# EAGLE design hashlet_bbb (EAGLE 6.5.0)
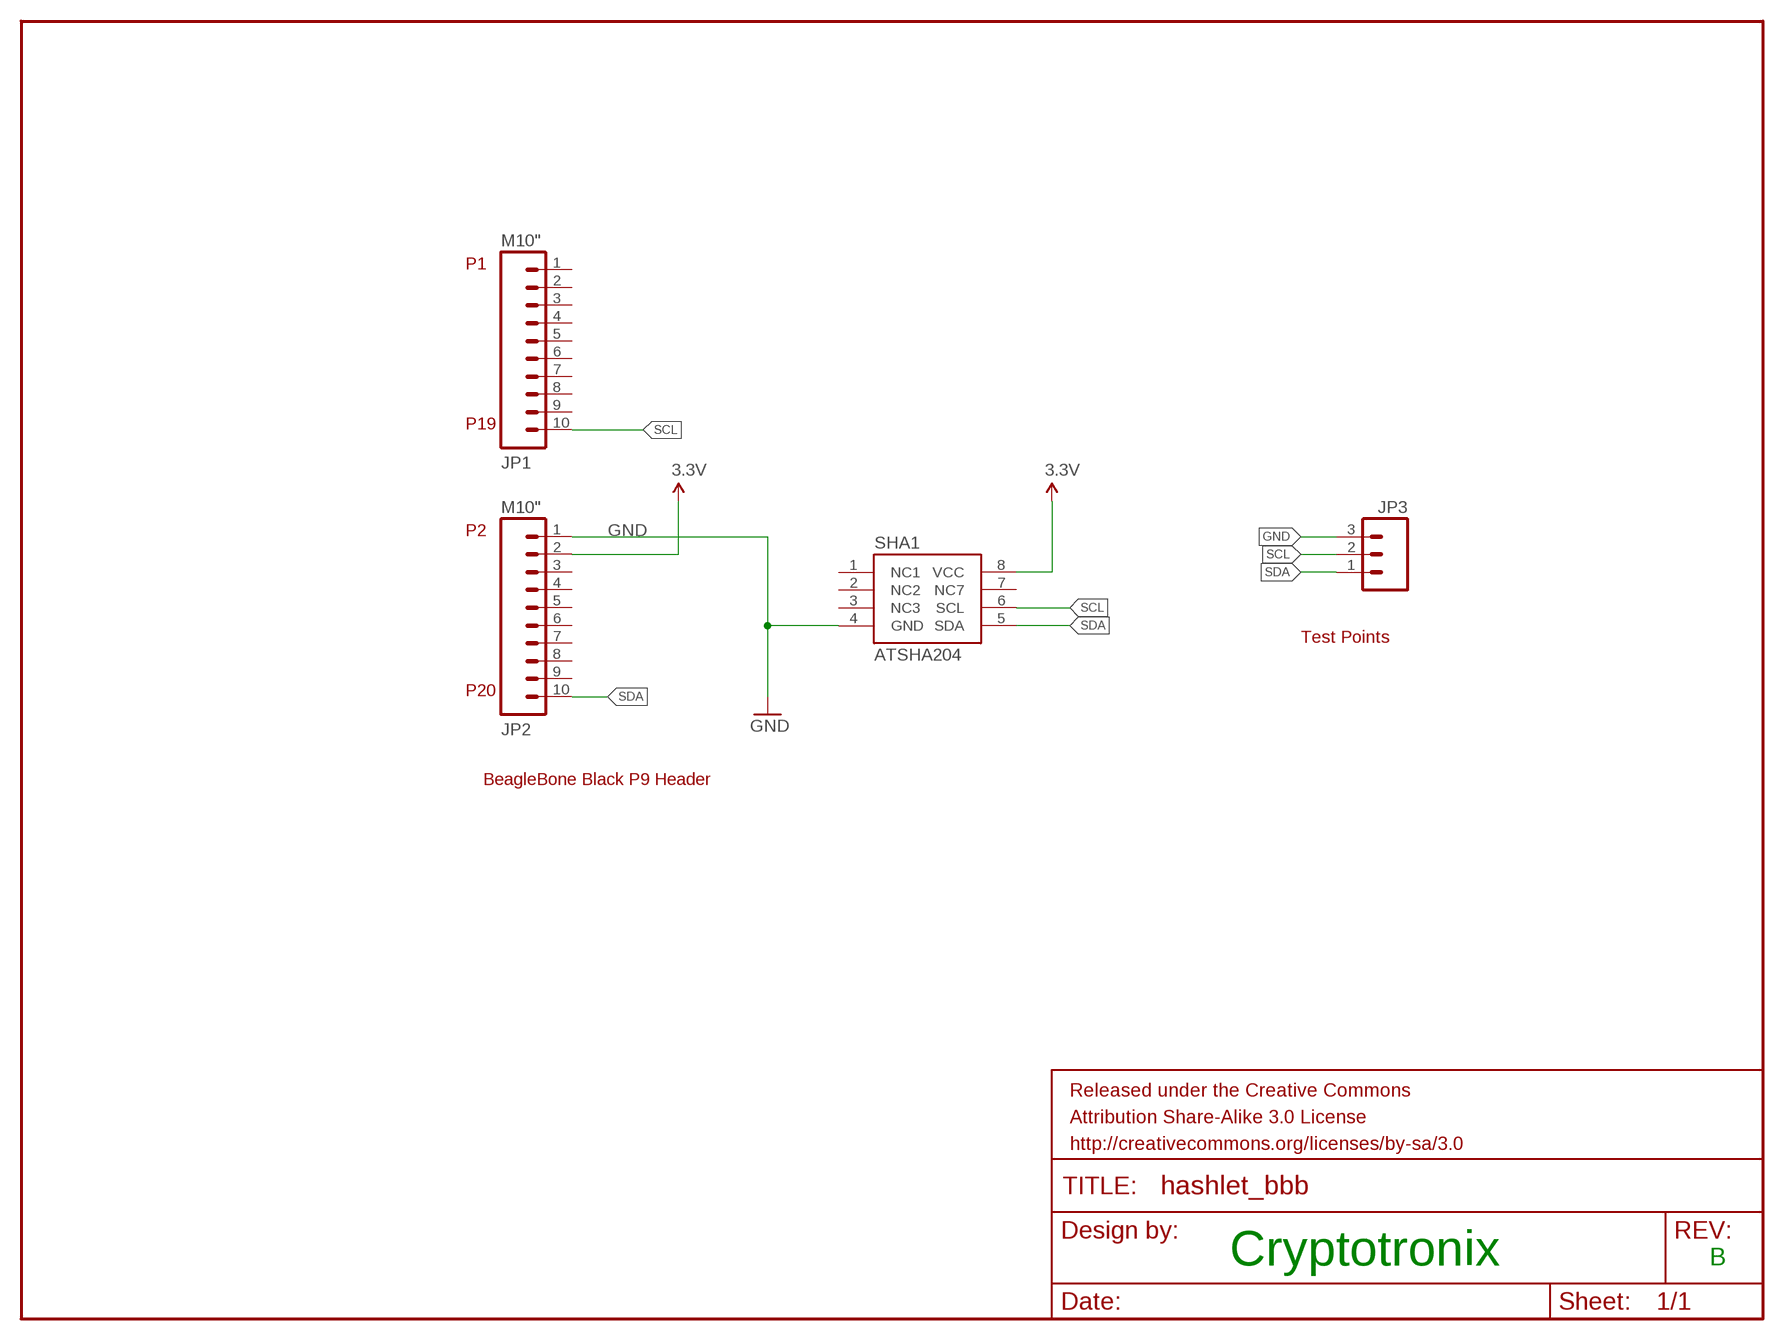
[diagram p0: schematic, sheet 1]

## Parts
FRAME1  FRAME-LETTER  [CREATIVE_COMMONS]
JP1  M10"  [1X10]
JP2  M10"  [1X10]
JP3  M03PTH  [1X03]
SHA1  ATSHA204  [SOIC8]

## Nets
3.3V: JP2.2 SHA1.8(VCC)
GND: JP2.1 JP3.3 SHA1.4(GND)
SCL: JP1.10 JP3.2 SHA1.6(SCL)
SDA: JP2.10 JP3.1 SHA1.5(SDA)
Unconnected: JP1.1 JP1.2 JP1.3 JP1.4 JP1.5 JP1.6 JP1.7 JP1.8 JP1.9 JP2.3 JP2.4 JP2.5 JP2.6 JP2.7 JP2.8 JP2.9 SHA1.1(NC1) SHA1.2(NC2) SHA1.3(NC3) SHA1.7(NC7)

## Notes on the sheet
- P1
- P19
- P2
- Test Points
- P20
- BeagleBone Black P9 Header
- Cryptotronix | B

## Library data of the parts
FRAME1 = SparkFun-Aesthetics:FRAME-LETTER: Schematic Frame Standard 8.5x11 US Letter frame
JP1 JP2 = SparkFun-Connectors:M10: Header 10 Standard 10-pin 0.1" header. Use with straight break away headers (SKU : PRT-00116), right angle break away headers (PRT-00553), swiss pins (PRT-00743), machine pins (PRT-00117), and female headers (PRT-00115).
JP3 = SparkFun-Connectors:M03: Header 3 Standard 3-pin 0.1" header. Use with straight break away headers (SKU : PRT-00116), right angle break away headers (PRT-00553), swiss pins (PRT-00743), machine pins (PRT-00117), and female headers (PRT-00115). Molex polarized connector foot print use with SKU : PRT-08232 with associated crimp pins and housings.
SHA1 = cryptotronix:ATSHA204: ATSHA204

## Board
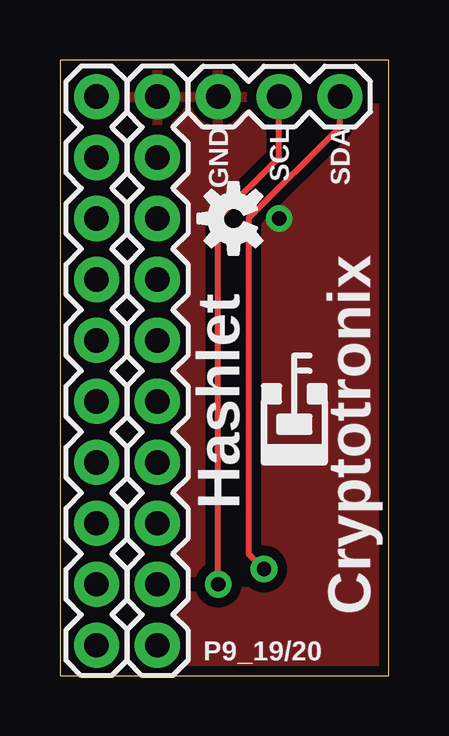
[diagram p1: board, top side]
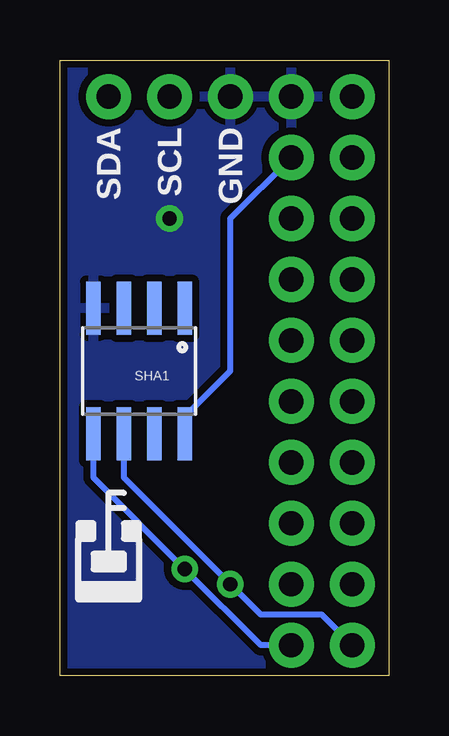
[diagram p2: board, bottom side, seen from below]

Size 13.72 x 25.65 mm. Coordinates in mm from the lower left corner, seen from the top.
Outline: 0,0 13.72,0 13.72,25.65 0,25.65 0,0
Copper layers (1*16): Top 0.035mm / dielectric 1.5mm / Bottom 0.035mm
Design rules "SparkFun": minimum track width 8mil, minimum drill 20mil, track to track 8mil, track to pad 8mil, pad to pad 8mil, via to via 8mil, smd to smd 8mil, copper to edge 10mil, drill to drill 8mil, minimum pad ring 12mil, minimum via ring 10mil, stop-mask expansion 4mil, vias tented up to drill 25mil, thermal gap 10mil

### Footprints (pad centres in the part's own frame; a part is rotated, then mirrored left to right if it is on the bottom)
1X10 = drill 1.016 pad 1.88: 1 0,0; 2 2.54,0; 3 5.08,0; 4 7.62,0; 5 10.16,0; 6 12.7,0; 7 15.24,0; 8 17.78,0; 9 20.32,0; 10 22.86,0
1X03 = drill 1.016 pad 1.88: 1 0,0; 2 2.54,0; 3 5.08,0
SOIC8 = smd 0.61 x 2.21: 1 -1.905,-2.616; 2 -0.635,-2.616; 3 0.635,-2.616; 4 1.905,-2.616; 5 1.905,2.616; 6 0.635,2.616; 7 -0.635,2.616; 8 -1.905,2.616

### Placement (x,y rotation side)
FRAME1  19.3,-10.16 0 top  (outside the outline)
JP1  1.52,24.13 270 top
JP2  4.06,24.13 270 top
JP3  11.68,24.13 180 top
SHA1  10.41,12.7 180 bottom
U$1  [OSHW-LOGO-S]  7.24,19.05 90 top

### Tracks (layer width: path | path; a pad name or v marks a point on that pad's centre or on a via)
3.3V
  Bottom 0.254: SHA1.8 8.51,10.8 6.6,12.7 6.6,19.05 JP2.2
GND  (via drill 0.6)
  other vias: 9.14,19.05
  pour Top (isolate 0.406): -1.02,-2.54 16.76,-2.54 16.76,26.67 -1.02,26.67
  pour Bottom (isolate 0.305): -1.02,26.67 16.76,26.67 16.76,-2.54 -1.02,-2.54
SCL  (via drill 0.6)
  Top 0.254: v6.6,3.81 6.6,19.05 9.14,21.59 JP3.2
  Bottom 0.254: JP1.10 2.79,2.54 5.33,2.54 v6.6,3.81 11.05,8.25 SHA1.6
SDA  (via drill 0.6)
  Top 0.254: JP3.1 11.68,22.86 7.87,19.05 7.87,5.08 v8.51,4.45
  Bottom 0.254: JP2.10 5.33,1.27 v8.51,4.45 12.32,8.25 SHA1.5

### Text on the board
tPlace: GND | SCL | SDA | Hashlet | Cryptotronix | P9_19/20 | Cryptotronix
bPlace: GND | SCL | SDA